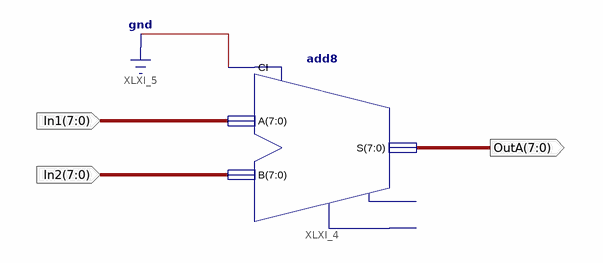
[diagram p0: schematic sheet 1]
// Xilinx ISE schematic Add.sch (spartan6) as structural Verilog: 1 symbols, 3 ports
module Add (
  input  [7:0] In1,
  input  [7:0] In2,
  output [7:0] OutA
);

  add8 XLXI_4 (.A(In1), .B(In2), .CI(1'b0), .S(OutA));  // open: CO, OFL
endmodule
